# EAGLE design MCU Board V1.1.0 (EAGLE 6.5.0)
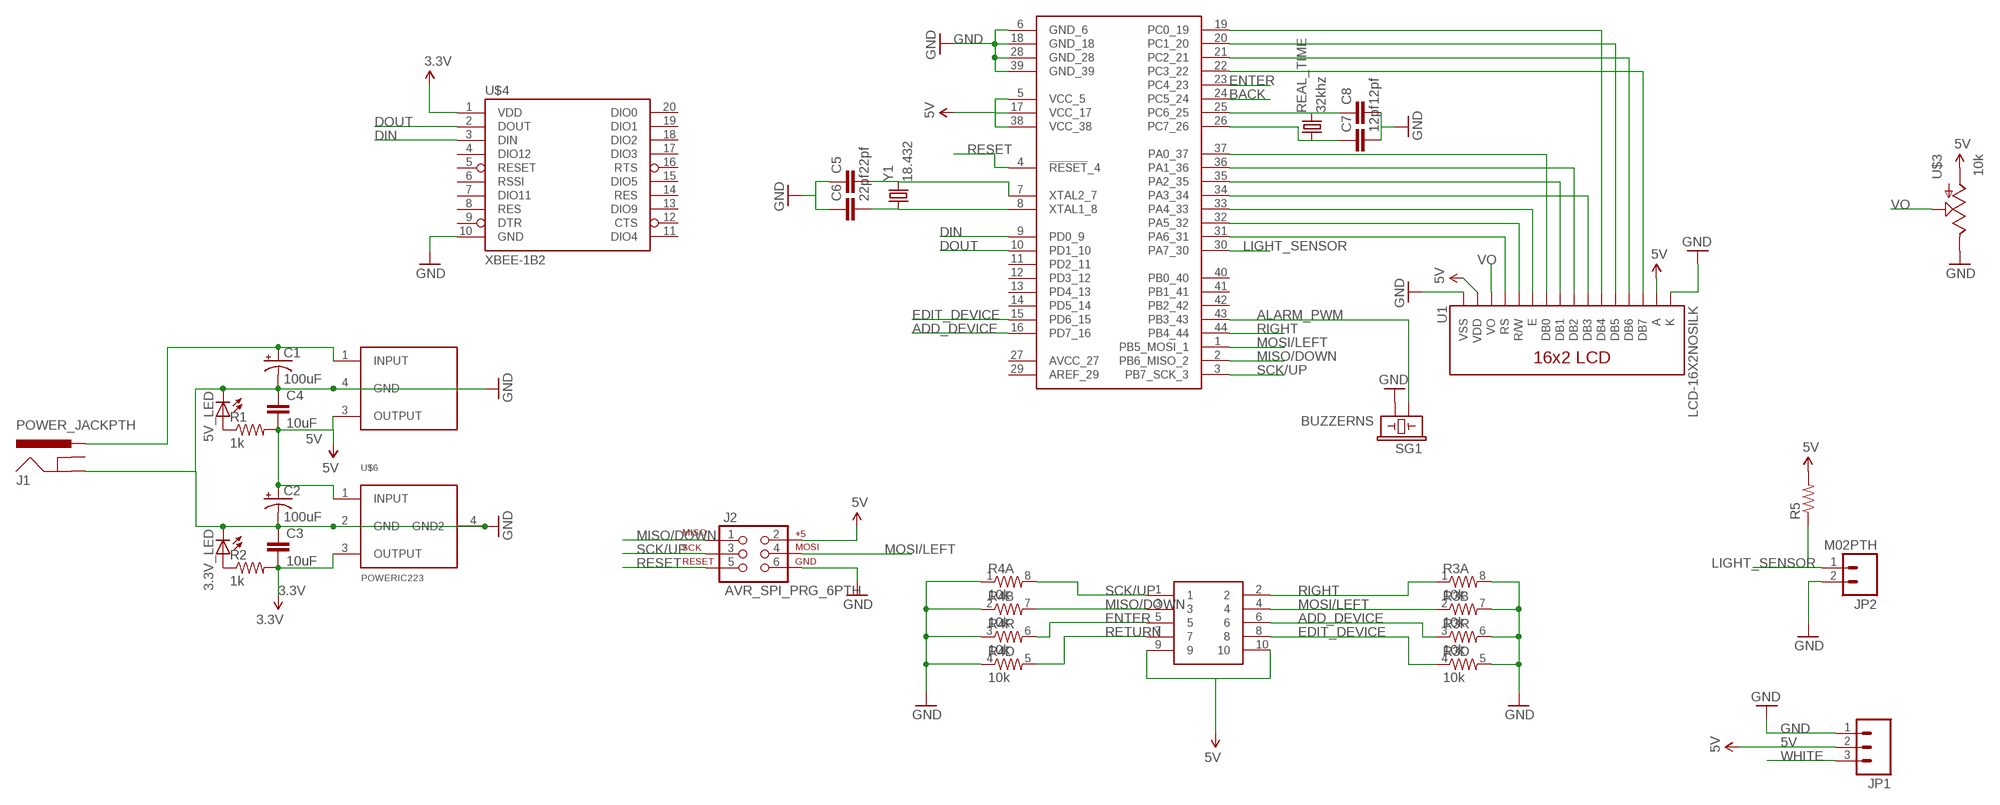
[diagram p0: schematic, sheet 1]

## Parts
3.3V_LED  LED1206  [LED-1206]
5V_LED  LED1206  [LED-1206]
C1  100uF  CAP_POLD  [PANASONIC_D]
C2  100uF  CAP_POLD  [PANASONIC_D]
C3  10uF  CAP1206  [1206]
C4  10uF  CAP1206  [1206]
C5  22pf  CAP0805  [0805]
C6  22pf  CAP0805  [0805]
C7  12pf  CAP0805  [0805]
C8  12pf  CAP0805  [0805]
J1  POWER_JACKPTH  [POWER_JACK_PTH]
J2  AVR_SPI_PRG_6PTH  [2X3]
JP1  M03PTH  [1X03]
JP2  M02PTH  [1X02]
R1  1k  RESISTOR1206  [1206]
R2  1k  RESISTOR1206  [1206]
R3  10k  RESISTOR-ARRAY0603-ARV  [0603-ARV]
R4  10k  RESISTOR-ARRAY0603-ARV  [0603-ARV]
R5  RESISTOR1206  [1206]
REAL_TIME  32khz  CRYSTALTC26H  [TC26H]
SG1  BUZZERNS  [BUZZER-12MM-NS]
U1  LCD-16X2NOSILK  [LCD-16X2_NOSILK]
U$1  ATMEGA1284  [TQFP44]
U$2  10PIN_HEADER_MALETHROUGH-HOLE  [2X5-SHROUDED]
U$3  10k  POTTRIM  [TRIM_POT]
U$4  XBEE-1B2  [XBEE-SILK]
U$5  DPACK_V_REG  [DPAK]
U$6  POWERIC223  [SOT223]
Y1  18.432  CRYSTALHC49US  [HC49US]

## Nets
3.3V: C3.2 R2.2 U$4.1(VDD) U$6.3(OUTPUT)
5V: C2.+ C4.2 J2.2 JP1.2 R1.2 R5.2 U1.2(VDD) U1.15(A) U$1.5(VCC_5) U$1.17(VCC_17) U$1.38(VCC_38) U$2.9 U$2.10 U$3.3(A) U$5.3(OUTPUT) U$6.1(INPUT)
ADD_DEVICE: R3.3 U$1.16(PD7_16) U$2.6
ALARM_PWM: SG1.+ U$1.43(PB3_43)
BACK: U$1.24(PC5_24)
DIN: U$1.9(PD0_9) U$4.3(DIN)
DOUT: U$1.10(PD1_10) U$4.2(DOUT)
EDIT_DEVICE: R3.4 U$1.15(PD6_15) U$2.8
ENTER: R4.6 U$1.23(PC4_23) U$2.5
GND: 3.3V_LED.C 5V_LED.C C1.- C2.- C3.1 C4.1 C5.1 C6.1 C7.2 C8.2 J1.GND J2.6 JP1.1 JP2.2 R3.5 R3.6 R3.7 R3.8 R4.1 R4.2 R4.3 R4.4 SG1.- U1.1(VSS) U1.16(K) U$1.6(GND_6) U$1.18(GND_18) U$1.28(GND_28) U$1.39(GND_39) U$3.2(E) U$4.10(GND) U$5.4(GND) U$6.2(GND) U$6.4(GND2)
LIGHT_SENSOR: JP2.1 R5.1 U$1.30(PA7_30)
MISO/DOWN: J2.1 R4.7 U$1.2(PB6_MISO_2) U$2.3
MOSI/LEFT: J2.4 R3.2 U$1.1(PB5_MOSI_1) U$2.4
N$1: C7.1 REAL_TIME.1 U$1.26(PC7_26)
N$2: C5.2 U$1.7(XTAL2_7) Y1.2
N$3: C6.2 U$1.8(XTAL1_8) Y1.1
N$4: C8.1 REAL_TIME.2 U$1.25(PC6_25)
N$5: 5V_LED.A R1.1
N$6: 3.3V_LED.A R2.1
N$7: U1.7(DB0) U$1.37(PA0_37)
N$8: U1.9(DB2) U$1.36(PA1_36)
N$9: U1.8(DB1) U$1.35(PA2_35)
N$10: U1.10(DB3) U$1.34(PA3_34)
N$11: U1.6(E) U$1.33(PA4_33)
N$12: U1.5(R/W) U$1.32(PA5_32)
N$13: U1.4(RS) U$1.31(PA6_31)
N$14: U1.11(DB4) U$1.19(PC0_19)
N$15: U1.12(DB5) U$1.20(PC1_20)
N$16: U1.13(DB6) U$1.21(PC2_21)
N$17: U1.14(DB7) U$1.22(PC3_22)
PWR: C1.+ J1.PWR U$5.1(INPUT)
RESET: J2.5 U$1.4(!RESET!_4)
RETURN: R4.5 U$2.7
RIGHT: R3.1 U$1.44(PB4_44) U$2.2
SCK/UP: J2.3 R4.8 U$1.3(PB7_SCK_3) U$2.1
VO: U1.3(VO) U$3.1(S)
WHITE: JP1.3
Unconnected: J1.GNDBREAK U$1.11(PD2_11) U$1.12(PD3_12) U$1.13(PD4_13) U$1.14(PD5_14) U$1.27(AVCC_27) U$1.29(AREF_29) U$1.40(PB0_40) U$1.41(PB1_41) U$1.42(PB2_42) U$4.4(DIO12) U$4.5(RESET) U$4.6(RSSI) U$4.7(DIO11) U$4.8(RES) U$4.9(DTR) U$4.11(DIO4) U$4.12(CTS) U$4.13(DIO9) U$4.14(RES) U$4.15(DIO5) U$4.16(RTS) U$4.17(DIO3) U$4.18(DIO2) U$4.19(DIO1) U$4.20(DIO0)

## Library data of the parts
3.3V_LED 5V_LED = SparkFun-LED:LED: LEDs Standard schematic elements and footprints for 5mm, 3mm, 1206, and 0603 sized LEDs. 5mm - Spark Fun Electronics SKU : COM-00529 (and others)
C1 C2 = SparkFun-Capacitors:CAP_POL: Capacitor Polarized These are standard SMD and PTH capacitors. Normally 10uF, 47uF, and 100uF in electrolytic and tantalum varieties. Always verify the external diameter of the through hole cap, it varies with capacity, voltage, and manufacturer. The EIA devices should be standard.
C3-C6 = SparkFun-Capacitors:CAP: Capacitor Standard 0603 ceramic capacitor, and 0.1" leaded capacitor.
C7 C8 = SparkFun-Passives:CAP: Capacitor Standard 0603 ceramic capacitor, and 0.1" leaded capacitor.
J1 = SparkFun-Connectors:POWER_JACK: Power Jack This is the standard 5.5mm barrel jack for power. The PTH is the most common, proven, reliable, footprint. The Slot footprint only works if the mill layer is transmitted to the PCB fab house so be warned. Spark Fun Electronics SKU : PRT-00119 SMT: CONN-08106 Mating wall wart : TOL-00298 (and others)
J2 = SparkFun-Connectors:AVR_SPI_PRG_6: AVR ISP 6 Pin This is the reduced ISP connector for AVR programming. Common on Arduino. This footprint will take up less PCB space and can be used with a 10-pin to 6-pin adapter such as SKU: BOB-08508
JP1 = SparkFun-Connectors:M03: Header 3 Standard 3-pin 0.1" header. Use with straight break away headers (SKU : PRT-00116), right angle break away headers (PRT-00553), swiss pins (PRT-00743), machine pins (PRT-00117), and female headers (PRT-00115). Molex polarized connector foot print use with SKU : PRT-08232 with associated crimp pins and housings.
JP2 = SparkFun-Connectors:M02: Standard 2-pin 0.1" header. Use with - straight break away headers ( PRT-00116) - right angle break away headers (PRT-00553) - swiss pins (PRT-00743) - machine pins (PRT-00117) - female headers (PRT-00115) Molex polarized connector foot print use with: PRT-08233 with associated crimp pins and housings. 2.54_SCREWTERM for use with PRT-10571. 3.5mm Screw Terminal footprints for PRT-08084 5mm Screw Terminal footprints for use with PRT-08433
R1 R2 R5 = SparkFun-Resistors:RESISTOR: Resistor Basic schematic elements and footprints for 0603, 1206, and PTH resistors.
R3 R4 = SparkFun-Resistors:RESISTOR-ARRAY: Array Chip Resistor Source: RS Component / Phycomp
REAL_TIME Y1 = SparkFun-FreqCtrl:CRYSTAL: Various standard crystals. Proven footprints. Spark Fun Electronics SKU : COM-00534
SG1 = SparkFun-Electromechanical:BUZZER: Buzzer 12mm Spark Fun Electronics SKU : Comp-Buzzer
U1 = SparkFun-Displays:LCD-16X2: Standard text-only 16x2 parallel input LCD
U$1 = NU STEM:ATMEGA1284
U$2 = NU STEM:10PIN_HEADER_MALE
U$3 = SparkFun-Electromechanical:POT
U$4 = SparkFun-RF:XBEE-1: Xbee module footprints SMT header is CONN-09042.
U$5 = NU STEM:DPACK_V_REG
U$6 = NU STEM:POWERIC223

## Board
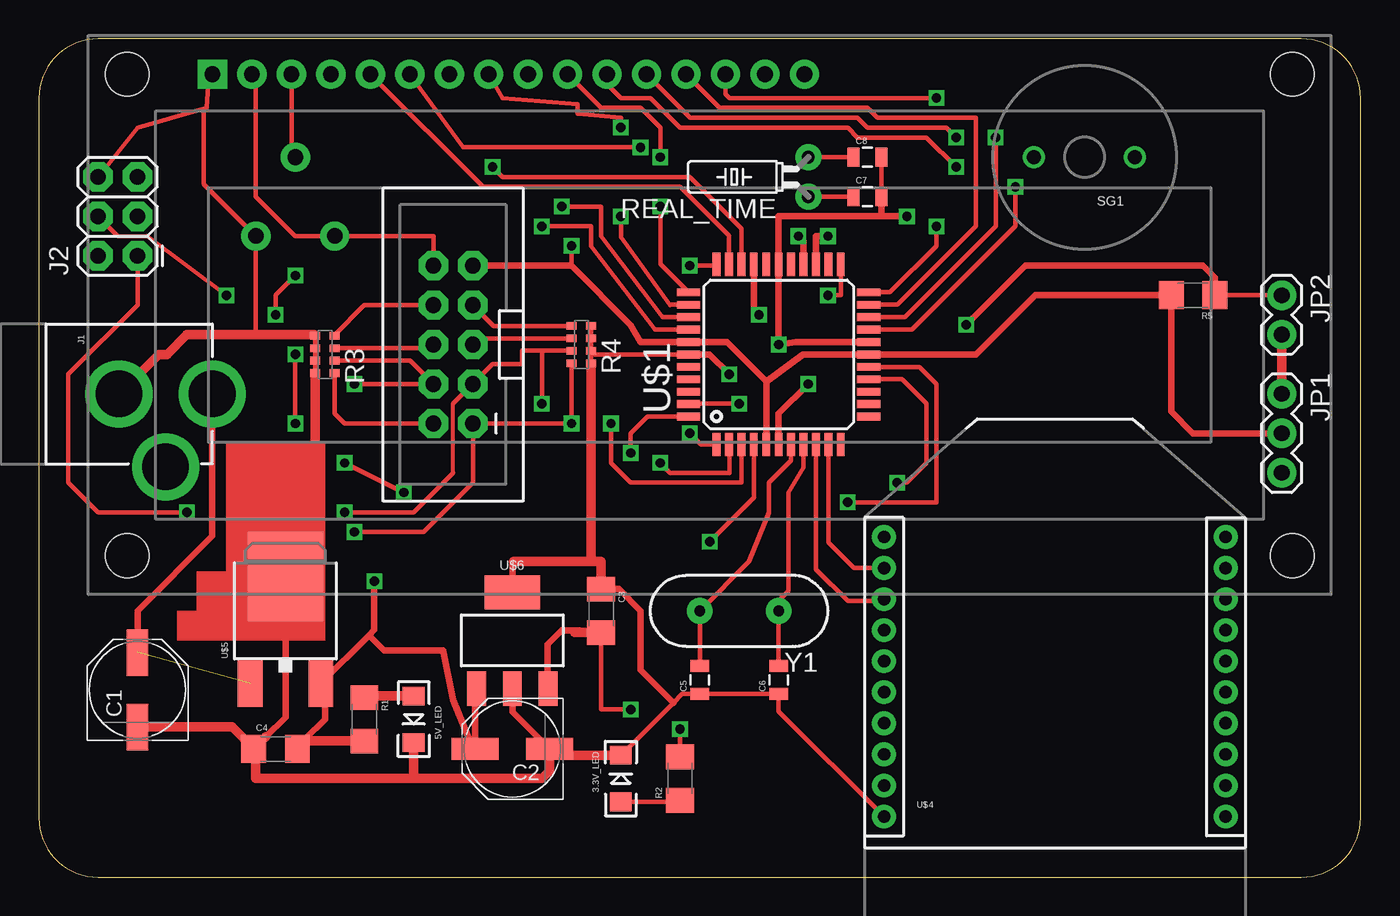
[diagram p1: board, top side]
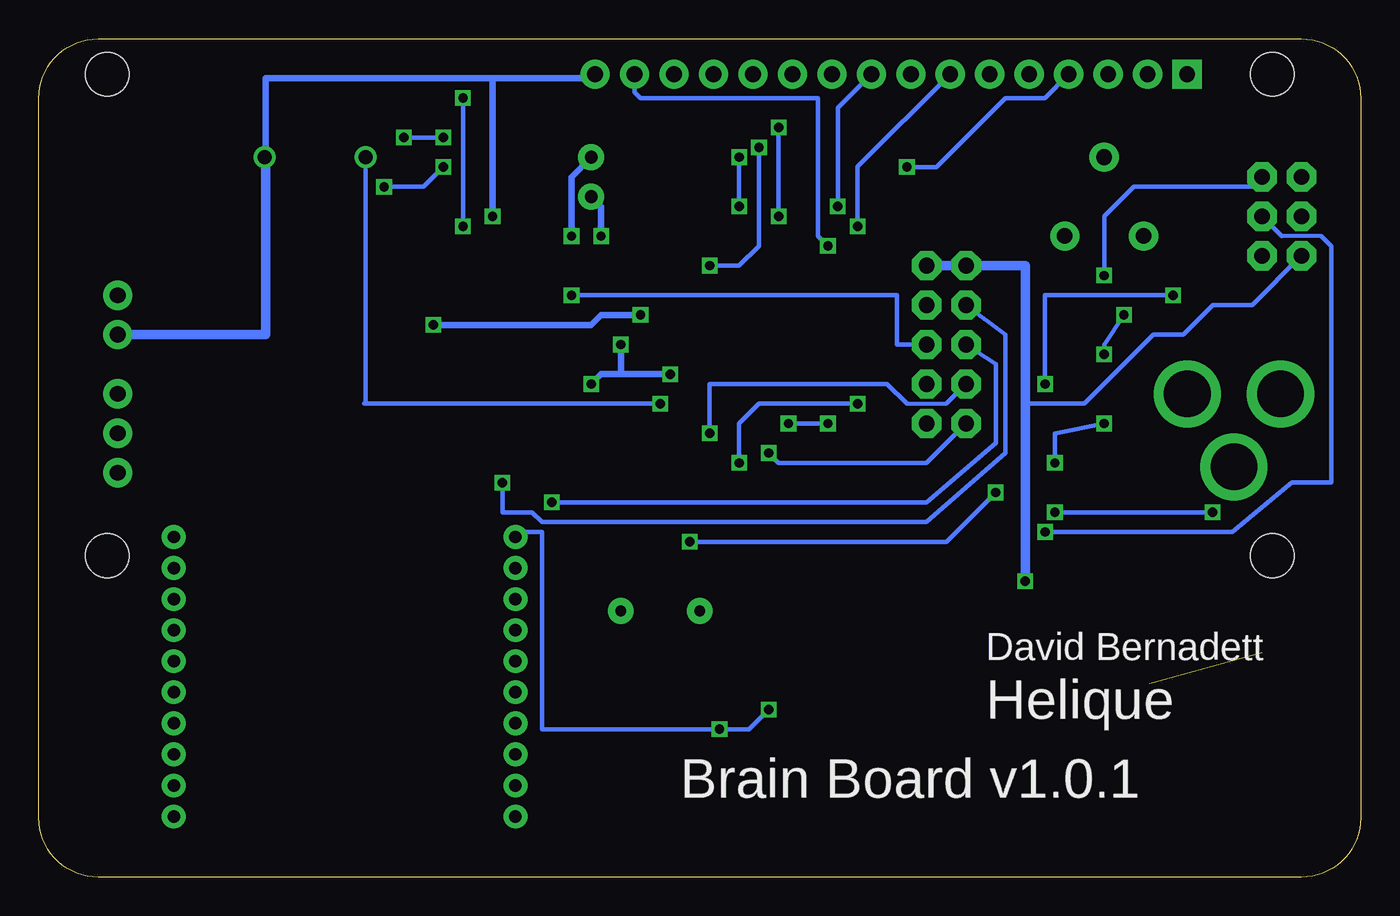
[diagram p2: board, bottom side, seen from below]

Size 85.09 x 53.98 mm. Coordinates in mm from the lower left corner, seen from the top.
Outline: 81.28,53.98 3.81,53.98 arc90 0,50.16 0,3.81 arc90 3.81,0 81.28,0 arc90 85.09,3.81 85.09,50.16 arc90 81.28,53.98
Copper layers (1*16): Top 0.035mm / dielectric 1.5mm / Bottom 0.035mm
Design rules "default": minimum track width 10mil, minimum drill 24mil, track to track 8mil, track to pad 8mil, pad to pad 8mil, via to via 8mil, smd to smd 8mil, copper to edge 40mil, drill to drill 8mil, minimum pad ring 10mil, minimum via ring 8mil, stop-mask expansion 4mil, vias tented up to drill 0mil, thermal gap 10mil

### Footprints (pad centres in the part's own frame; a part is rotated, then mirrored left to right if it is on the bottom)
LED-1206 = smd 1.2 x 1.4: A -1.5,0; C 1.5,0
PANASONIC_D = smd 3 x 1.4: + 2.4,0; - -2.4,0
1206 = smd 1.6 x 1.8: 1 -1.4,0; 2 1.4,0
0805 = smd 0.8 x 1.2: 1 -0.9,0; 2 0.9,0
POWER_JACK_PTH = drill 2.997 pad 4.318: GND 0,7.7; GNDBREAK 4.7,10.7; PWR 0,13.7
2X3 = drill 1.016 pad 1.88 octagon: 1 0,0; 2 0,2.54; 3 2.54,0; 4 2.54,2.54; 5 5.08,0; 6 5.08,2.54
1X03 = drill 1.016 pad 1.88: 1 0,0; 2 2.54,0; 3 5.08,0
1X02 = drill 1.016 pad 1.88: 1 0,0; 2 2.54,0
0603-ARV = smd 0.5 x 0.65: 1 -1.2,-0.625; 2 -0.4,-0.625; 3 0.4,-0.625; 4 1.2,-0.625; 5 1.2,0.625; 6 0.4,0.625; 7 -0.4,0.625; 8 -1.2,0.625
TC26H = drill 0.813 pad 1.676: 1 -1.27,0; 2 1.27,0
BUZZER-12MM-NS = drill 0.9: + 3.25,0; - -3.25,0
LCD-16X2_NOSILK = drill 1.016 pad 1.88 square: 1 -32,15.5 | drill 1.016 pad 1.88: 2 -29.46,15.5; 3 -26.92,15.5; 4 -24.38,15.5; 5 -21.84,15.5; 6 -19.3,15.5; 7 -16.76,15.5; 8 -14.22,15.5; 9 -11.68,15.5; 10 -9.14,15.5; 11 -6.6,15.5; 12 -4.06,15.5; 13 -1.52,15.5; 14 1.02,15.5; 15 3.56,15.5; 16 6.1,15.5 | hole 2.8: -37.5,15.5; -37.5,-15.5; 37.5,15.5; 37.5,-15.5
TQFP44 = smd 1.5 x 0.5: 1 -5.8,4; 2 -5.8,3.2; 3 -5.8,2.4; 4 -5.8,1.6; 5 -5.8,0.8; 6 -5.8,0; 7 -5.8,-0.8; 8 -5.8,-1.6; 9 -5.8,-2.4; 10 -5.8,-3.2; 11 -5.8,-4; 23 5.8,-4; 24 5.8,-3.2; 25 5.8,-2.4; 26 5.8,-1.6; 27 5.8,-0.8; 28 5.8,0; 29 5.8,0.8; 30 5.8,1.6; 31 5.8,2.4; 32 5.8,3.2; 33 5.8,4 | smd 0.5 x 1.5: 12 -4,-5.8; 13 -3.2,-5.8; 14 -2.4,-5.8; 15 -1.6,-5.8; 16 -0.8,-5.8; 17 0,-5.8; 18 0.8,-5.8; 19 1.6,-5.8; 20 2.4,-5.8; 21 3.2,-5.8; 22 4,-5.8; 34 4,5.8; 35 3.2,5.8; 36 2.4,5.8; 37 1.6,5.8; 38 0.8,5.8; 39 0,5.8; 40 -0.8,5.8; 41 -1.6,5.8; 42 -2.4,5.8; 43 -3.2,5.8; 44 -4,5.8
2X5-SHROUDED = drill 1.016 pad 1.88 octagon: 1 -1.27,5.08; 2 1.27,5.08; 3 -1.27,2.54; 4 1.27,2.54; 5 -1.27,0; 6 1.27,0; 7 -1.27,-2.54; 8 1.27,-2.54; 9 -1.27,-5.08; 10 1.27,-5.08
TRIM_POT = drill 1 pad 1.88: 1 5.08,0; 2 0,2.54; 3 0,-2.54
XBEE-SILK = drill 0.8 pad 1.524: 1 -11,20; 2 -11,18; 3 -11,16; 4 -11,14; 5 -11,12; 6 -11,10; 7 -11,8; 8 -11,6; 9 -11,4; 10 -11,2; 11 11,2; 12 11,4; 13 11,6; 14 11,8; 15 11,10; 16 11,12; 17 11,14; 18 11,16; 19 11,18; 20 11,20
DPAK = smd 1.6 x 3: 1 -2.28,-5.31; 3 2.28,-5.31 | smd 4.826 x 5.715: 4 0,1.588
SOT223 = smd 1.219 x 2.235: 1 -2.311,-3.099; 2 0,-3.099; 3 2.311,-3.099 | smd 3.6 x 2.2: 4 0,3.099
HC49US = drill 0.7 pad 1.651: 1 -2.54,0; 2 2.54,0

### Placement (x,y rotation side)
3.3V_LED  37.47,6.35 90 top
5V_LED  24.13,10.16 270 top
C1  6.35,12.06 90 top
C2  30.48,8.26 180 top
C3  36.2,17.14 270 top
C4  15.24,8.26 0 top
C5  42.55,12.7 90 top
C6  47.62,12.7 90 top
C7  53.34,43.81 0 top
C8  53.34,46.35 0 top
J1  -2.54,31.11 270 top
J2  6.35,40.01 90 top
JP1  80.01,31.11 270 top
JP2  80.01,37.47 270 top
R1  20.95,10.16 270 top
R2  41.27,6.35 90 top
R3  18.41,33.66 90 top
R4  34.92,34.29 90 top
R5  74.3,37.47 180 top
REAL_TIME  49.53,45.09 90 top
SG1  67.31,46.35 180 top
U1  43.18,36.2 0 top
U$1  47.62,33.66 90 top
U$2  26.67,34.29 180 top
U$3  16.51,41.27 90 top
U$4  65.41,1.91 0 top
U$5  15.88,17.78 0 top
U$6  30.48,15.24 0 top
Y1  45.09,17.14 180 top

### Tracks (layer width: path | path; a pad name or v marks a point on that pad's centre or on a via)
3.3V  (via drill 0.6)
  Top 0.305: R2.2 v41.27,9.53 | v38.1,10.79 36.2,10.79 C3.2
  Top 0.406: 34.92,15.74 34.8,15.88 33.66,15.88 32.76,14.98 32.76,12.17 U$6.3
  Top 0.61: 34.49,15.74 34.92,15.74 C3.2
  Bottom 0.305: v38.1,10.79 39.37,9.53 v41.27,9.53 52.7,9.53 52.7,22.23 54.09,22.23 U$4.1
5V  (via drill 0.6)
  Top 0.305: 34.29,39.37 v34.29,40.64 | U1.2 13.97,51.45 13.97,43.81 16.51,41.27 U$3.3 25.4,41.27 U$2.10
  Top 0.406: U$2.9 34.29,39.37 38.1,35.56 38.73,34.45 U$1.38 44.28,34.45 46.83,31.91 | 46.83,31.91 U$1.5 | 46.83,31.91 49.2,33.66 U$1.17 60.33,33.66 64.14,37.47 R5.2 72.89,29.98 74.3,28.57 JP1.2 | 17.14,8.76 17.14,8.89 18.41,10.16 18.41,12.21 U$5.3 21.26,15.57 | v21.59,19.05 21.59,15.9 21.26,15.57 | U$6.1 28.08,12.14 C2.+ 27.94,8.26 26.67,11.43 26.04,14.61 22.23,14.61 21.26,15.57
  Top 0.61: C4.2 17.14,8.76 R1.2
  Bottom 0.305: v34.29,40.64 34.92,41.27 34.92,50.16 46.35,50.16 46.74,50.55 U1.15 | J2.2 6.99,36.83 9.53,36.83 11.43,34.92 13.34,34.92 17.78,30.48 21.59,30.48
  Bottom 0.61: v21.59,19.05 21.59,30.48 21.59,39.37 U$2.10 U$2.9
ADD_DEVICE  (via drill 0.6)
  Top 0.305: R3.3 25.16,34.05 U$2.6 | U$1.16 56.68,32.85 57.78,31.75 57.78,24.13 v52.07,24.13
  Bottom 0.305: v52.07,24.13 27.94,24.13 23.5,27.94 23.5,33.02 U$2.6
ALARM_PWM  (via drill 0.6)
  Top 0.305: U$1.43 41.85,30.48 v45.09,30.48
  Bottom 0.305: v45.09,30.48 64.14,30.48 64.06,30.55 SG1.+
DIN
  Top 0.305: U$4.3 54.28,17.78 52.07,17.78 50.02,19.82 U$1.9
DOUT
  Top 0.305: U$4.2 52.48,19.91 50.83,21.57 U$1.10
EDIT_DEVICE  (via drill 0.6)
  Top 0.305: R3.4 19.04,34.91 20.95,36.83 U$2.8 | U$1.15 55.58,32.05 57.15,30.48 57.15,26.67 55.88,25.4 v55.24,25.4
  Bottom 0.305: v55.24,25.4 55.24,23.5 53.34,23.5 52.7,22.86 27.94,22.86 22.86,27.3 22.86,34.92 U$2.8
ENTER  (via drill 0.6)
  Top 0.305: U$1.23 51.62,37.47 v50.8,37.47 | R4.6 28.34,34.69 U$2.5
  Bottom 0.305: v50.8,37.47 29.84,37.47 29.84,34.29 U$2.5
GND  (via drill 0.6)
  Top 0.305: J2.6 6.35,48.26 10.63,49.48 | 10.63,49.48 10.79,49.53 10.92,51.44 U1.1 | 14.61,9.02 C4.1 | 33.28,7.85 C2.- | C8.2 C7.2 | U$4.10 47.62,10.69 C6.1 C5.1 41.41,11.8 40.84,11.23 3.3V_LED.C | 13.97,34.92 U$3.2 10.63,44.62 10.63,49.48 | R3.8 R3.7 R3.6 R3.5 | R4.4 R4.3 R4.2 | R4.2 35.78,33.66 U$1.39 | R4.2 R4.1
  Top 0.406: U$1.18 48.73,34.45 v47.62,34.29 U$1.28 47.62,42.55 54.24,42.55 | U$1.39 43.18,33.66 v44.45,32.38 | v49.53,31.75 47.62,29.84 U$1.6 | v55.88,42.55 54.24,42.55 | 54.24,42.55 C7.2 | 14.61,9.02 15.88,10.29 U$5.4 15.88,21.51 17.79,23.43 | 30.56,20.32 30.48,20.24 U$6.4 | C3.1 37.34,18.55 38.73,17.14 38.73,13.34 40.84,11.23 | U$6.2 30.48,10.65 C2.-
  Top 0.61: C1.- 12.43,9.66 C4.1 | 17.79,23.43 17.79,31.11 | 17.79,31.11 R3.8 | J1.GND 7.7,33.66 8.26,33.66 9.53,34.92 13.97,34.92 17.72,34.92 R3.5 | 17.78,31.11 17.79,31.11 | 14.61,9.02 13.97,8.38 13.97,6.35 24.13,6.35 | 5V_LED.C 24.13,6.35 | 24.13,6.35 32.38,6.35 32.88,6.84 C2.- | 33.28,7.85 3.3V_LED.C | 30.56,20.32 35.56,20.32 | 35.56,20.32 36.2,20.32 C3.1 | R4.1 35.56,20.32 | JP2.2 JP1.1
  Bottom 0.406: v44.45,32.38 47.62,32.38 | v49.53,31.75 48.9,32.38 47.62,32.38 | 47.62,32.38 v47.62,34.29 | 70.48,46.35 70.48,51.44 55.88,51.44 | U1.16 49.28,51.44 55.88,51.44 | 55.88,51.44 v55.88,42.55
  Bottom 0.61: SG1.- 70.48,46.35 70.48,34.92 JP2.2
LIGHT_SENSOR  (via drill 0.6)
  Top 0.305: R5.1 JP2.1
  Top 0.406: R5.1 75.69,38.6 74.93,39.37 63.5,39.37 v59.69,35.56 | v46.35,36.2 46.02,36.52 U$1.30
  Bottom 0.406: v59.69,35.56 49.53,35.56 48.9,36.2 v46.35,36.2
MISO/DOWN  (via drill 0.6)
  Top 0.254: 26.67,26.04 26.67,30.48
  Top 0.305: 32.38,33.89 31.11,33.89 31.11,33.02 29.21,33.02 U$2.3 26.67,30.48 | 32.38,33.89 R4.7 | J2.1 6.35,36.83 1.91,32.38 1.91,25.4 3.81,23.5 v9.53,23.5 | v19.68,23.5 24.13,23.5 26.67,26.04 | U$1.2 44.45,27.83 44.45,26.04 40.64,26.04 v40.01,26.67 | v32.38,30.48 32.38,33.89
  Bottom 0.305: v9.53,23.5 v19.68,23.5 | v40.01,26.67 40.01,29.21 38.73,30.48 v32.38,30.48
MOSI/LEFT  (via drill 0.6)
  Top 0.254: 5.08,41.27 6.99,41.27
  Top 0.305: R3.2 23.89,33.26 U$2.4 v20.32,31.75 | J2.4 5.08,41.27 | 6.99,41.27 v12.06,37.47 | U$1.1 42.63,27.86 v41.91,28.57
  Bottom 0.254: 29.21,30.48 26.67,30.48
  Bottom 0.305: v12.06,37.47 20.32,37.47 v20.32,31.75 | v41.91,28.57 41.91,31.75 30.48,31.75 29.21,30.48 | 26.67,30.48 U$2.4
N$1  (via drill 0.6)
  Top 0.305: C7.1 REAL_TIME.1
  Top 0.406: U$1.26 49.23,40.95 v48.9,41.27
  Bottom 0.406: v48.9,41.27 48.9,43.18 REAL_TIME.1
N$2
  Top 0.305: C5.2 Y1.2 45.72,20.32 46.99,23.5 46.99,25.4 48.42,26.84 U$1.7
N$3
  Top 0.305: C6.2 Y1.1 47.62,17.78 48.26,18.41 48.26,24.77 49.23,26.36 U$1.8
N$4  (via drill 0.6)
  Top 0.305: REAL_TIME.2 C8.1
  Top 0.406: v50.8,41.27 50.02,41.27 U$1.25
  Bottom 0.406: REAL_TIME.2 50.8,45.09 v50.8,41.27
N$5
  Top 0.305: 24.03,11.56 5V_LED.A
  Top 0.61: R1.1 21.05,11.66 5V_LED.A
N$6
  Top 0.305: 3.3V_LED.A 41.17,4.85 R2.1
N$7  (via drill 0.6)
  Top 0.305: v32.38,41.91 35.56,41.91 35.56,40.64 39.67,35.26 U$1.37
  Bottom 0.305: U1.7 32.38,45.73 v32.38,41.91
N$8  (via drill 0.6)
  Top 0.305: v33.66,43.18 36.2,43.18 36.2,41.27 40.15,36.05 U$1.36
  Bottom 0.305: U1.9 33.66,49.54 v33.66,43.18
N$9  (via drill 0.6)
  Top 0.305: U$1.35 40.66,36.85 40.64,36.83 37.47,41.22 v37.47,42.55 | v37.47,48.26 37.47,48.9 34.67,49.15 34.67,49.78 29.84,50.16 U1.8
  Bottom 0.305: v37.47,42.55 v37.47,48.26
N$10  (via drill 0.6)
  Top 0.305: U$1.34 40.01,39.48 v40.01,43.18 | v40.01,46.35 40.01,48.26 38.73,49.53 36.2,49.53 34.04,51.69 U1.10
  Bottom 0.305: v40.01,43.18 v40.01,46.35
N$11  (via drill 0.6)
  Top 0.305: U$1.33 43.54,39.37 v41.91,39.37 | U1.6 27.3,47 27.94,46.99 v38.73,46.99
  Bottom 0.305: v41.91,39.37 40.01,39.37 38.73,40.64 v38.73,46.99
N$12
  Top 0.305: U$1.32 44.42,41.3 41.27,44.45 28.59,44.45 U1.5
N$13  (via drill 0.6)
  Top 0.305: U$1.31 45.23,41.77 41.91,45.09 29.84,45.09 v29.21,45.72
  Bottom 0.305: v29.21,45.72 27.3,45.72 22.86,50.16 20.33,50.16 U1.4
N$14  (via drill 0.6)
  Top 0.305: U$1.19 56.21,35.26 62.87,41.91 v62.87,44.45 | v59.05,45.72 57.15,47.62 52.7,47.62 52.07,48.26 41.27,48.26 39.37,50.16 37.47,50.16 36.58,51.05 U1.11
  Bottom 0.305: v62.87,44.45 60.33,44.45 v59.05,45.72
N$15  (via drill 0.6)
  Top 0.305: U$1.20 55.74,36.05 61.59,41.91 v61.59,47.62 | v59.05,47.62 58.42,48.26 53.34,48.26 52.7,48.9 41.92,48.9 U1.12
  Bottom 0.305: v61.59,47.62 v59.05,47.62
N$16
  Top 0.305: U$1.21 55.27,36.85 60.33,41.91 60.33,48.9 53.98,48.9 53.34,49.53 43.83,49.53 U1.13
N$17  (via drill 0.6)
  Top 0.305: U$1.22 54.8,37.66 57.78,40.64 v57.78,41.91 | v57.78,50.16 44.45,50.16 44.2,50.41 U1.14
  Bottom 0.305: v57.78,41.91 v57.78,50.16
PWR  (1 unrouted)
  Top 0.406: J1.PWR 11.16,21.95 6.35,17.14 C1.+
RESET  (via drill 0.6)
  Top 0.305: U$1.4 46.02,24.43 v43.18,21.59 | v23.5,24.77 v19.68,26.67 | v16.51,29.21 v16.51,33.66 | v15.24,36.2 15.24,37.47 v16.51,38.73
  Bottom 0.305: v43.18,21.59 26.67,21.59 v23.5,24.77 | v19.68,26.67 19.68,28.57 v16.51,29.21 | v16.51,33.66 16.51,34.29 v15.24,36.2 | v16.51,38.73 16.51,42.55 14.61,44.45 6.99,44.45 J2.5
RETURN
  Top 0.305: R4.5 29.28,35.49 U$2.7
RIGHT  (via drill 0.6)
  Top 0.305: R3.1 19.04,29.86 19.68,29.21 U$2.2 | v38.1,27.3 38.1,28.57 39.18,29.66 U$1.44
  Bottom 0.305: U$2.2 27.94,26.67 37.47,26.67 v38.1,27.3
SCK/UP  (via drill 0.6)
  Top 0.305: R4.8 v34.29,29.21 U$2.1 27.94,25.4 24.77,22.23 v20.32,22.23 | v36.83,29.21 36.83,26.67 38.1,25.4 45.23,25.4 U$1.3
  Bottom 0.254: 2.54,41.27 5.08,41.27
  Bottom 0.305: v34.29,29.21 v36.83,29.21 | v20.32,22.23 8.26,22.23 4.45,25.4 1.91,25.4 1.91,40.64 2.54,41.27 | 5.08,41.27 J2.3
VO
  Top 0.305: U1.3 16.26,46.6 U$3.1
(copper drawn outside any net)
  shapes: Top area x3

### Text on the board
bNames: David Bernadett | Helique | Brain Board v1.0.1